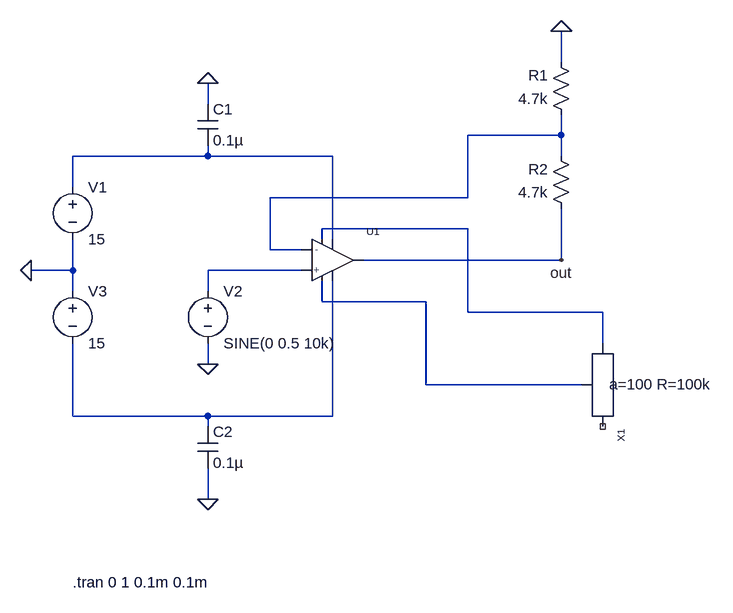
[diagram p0: schematic 741_block.asc]
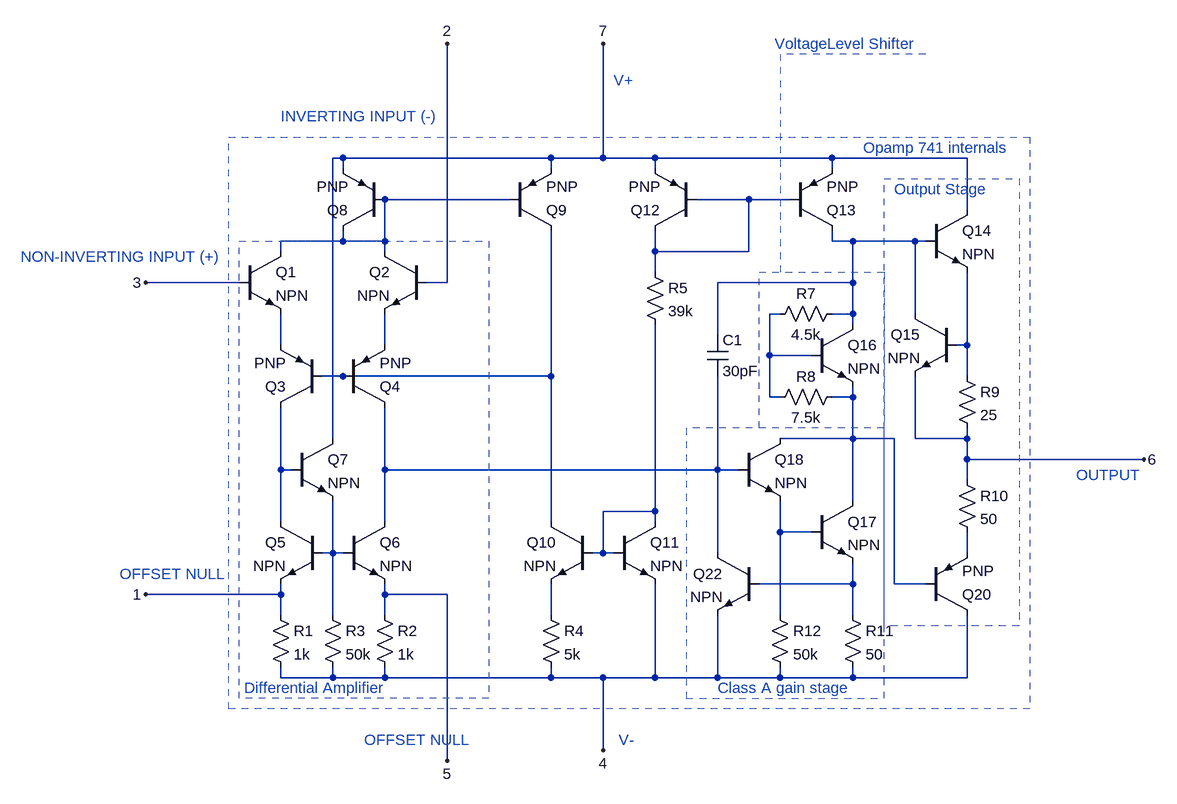
[diagram p1: sub-circuit 741.asc]
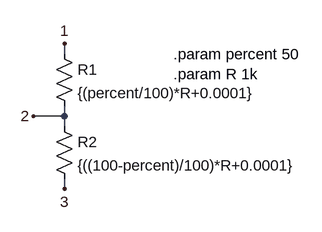
[diagram p2: sub-circuit potentionmeter.asc]
741_block.asc, the LTspice schematic file:
Version 4
SHEET 1 880 736
WIRE 416 -80 416 -128
WIRE -128 -16 -128 -48
WIRE 416 32 416 0
WIRE 416 32 272 32
WIRE -128 64 -128 48
WIRE -128 64 -336 64
WIRE 64 64 -128 64
WIRE 416 64 416 32
WIRE -336 112 -336 64
WIRE 272 128 272 32
WIRE 272 128 -32 128
WIRE 272 176 48 176
WIRE 48 192 48 176
WIRE 64 192 64 64
WIRE -32 208 -32 128
WIRE 16 208 -32 208
WIRE 416 224 416 144
WIRE 416 224 112 224
WIRE -336 240 -336 192
WIRE -336 240 -400 240
WIRE 16 240 -128 240
WIRE -336 272 -336 240
WIRE -128 272 -128 240
WIRE 48 288 48 256
WIRE 208 288 48 288
WIRE 272 304 272 176
WIRE 480 304 272 304
WIRE 480 352 480 304
WIRE -128 384 -128 352
WIRE 208 416 208 288
WIRE 448 416 208 416
WIRE -336 464 -336 352
WIRE -128 464 -336 464
WIRE 64 464 64 256
WIRE 64 464 -128 464
WIRE -128 480 -128 464
WIRE -128 592 -128 544
FLAG -128 384 0
FLAG -400 240 0
FLAG -128 592 0
FLAG -128 -48 0
FLAG 416 -128 0
FLAG 416 224 out
SYMBOL voltage -336 96 R0
WINDOW 123 0 0 Left 0
WINDOW 39 0 0 Left 0
SYMATTR InstName V1
SYMATTR Value 15
SYMBOL voltage -128 256 R0
WINDOW 123 0 0 Left 0
WINDOW 39 0 0 Left 0
SYMATTR InstName V2
SYMATTR Value SINE(0 0.5 10k)
SYMBOL voltage -336 256 R0
WINDOW 123 0 0 Left 0
WINDOW 39 0 0 Left 0
SYMATTR InstName V3
SYMATTR Value 15
SYMBOL cap -144 -16 R0
SYMATTR InstName C1
SYMATTR Value 0.1µ
SYMBOL cap -144 480 R0
SYMATTR InstName C2
SYMATTR Value 0.1µ
SYMBOL res 432 16 R180
WINDOW 0 36 76 Left 2
WINDOW 3 36 40 Left 2
SYMATTR InstName R1
SYMATTR Value 4.7k
SYMATTR SpiceLine tol=5
SYMBOL res 432 160 R180
WINDOW 0 36 76 Left 2
WINDOW 3 36 40 Left 2
SYMATTR InstName R2
SYMATTR Value 4.7k
SYMATTR SpiceLine tol=5
SYMBOL 741 32 224 R0
SYMATTR InstName U1
SYMBOL potentionmeter 464 368 R90
WINDOW 39 47 -185 VRight 2
SYMATTR InstName X1
SYMATTR SpiceLine a=100 R=100k
TEXT -336 720 Left 2 !.tran 0 1 0.1m 0.1m

741.asc, the sub-circuit schematic file:
Version 4
SHEET 1 2824 1124
WIRE 240 -16 224 -16
WIRE 560 -16 240 -16
WIRE 640 -16 640 -192
WIRE 640 -16 560 -16
WIRE 720 -16 640 -16
WIRE 992 -16 720 -16
WIRE 1200 -16 992 -16
WIRE 240 0 240 -16
WIRE 560 0 560 -16
WIRE 720 0 720 -16
WIRE 992 0 992 -16
WIRE 496 48 304 48
WIRE 864 48 784 48
WIRE 928 48 864 48
WIRE 1200 64 1200 -16
WIRE 240 112 240 96
WIRE 240 112 144 112
WIRE 304 112 304 48
WIRE 304 112 240 112
WIRE 992 112 992 96
WIRE 1024 112 992 112
WIRE 1120 112 1024 112
WIRE 1136 112 1120 112
WIRE 144 128 144 112
WIRE 304 128 304 112
WIRE 720 128 720 96
WIRE 864 128 864 48
WIRE 864 128 720 128
WIRE 720 160 720 128
WIRE 80 176 -64 176
WIRE 400 176 400 -192
WIRE 400 176 368 176
WIRE 1024 176 1024 112
WIRE 1024 176 816 176
WIRE 912 224 896 224
WIRE 1024 224 1024 176
WIRE 1024 224 992 224
WIRE 1120 224 1120 112
WIRE 1024 240 1024 224
WIRE 816 256 816 176
WIRE 144 272 144 224
WIRE 304 272 304 224
WIRE 1200 272 1200 160
WIRE 1200 272 1184 272
WIRE 896 288 896 224
WIRE 960 288 896 288
WIRE 240 320 208 320
WIRE 560 320 560 96
WIRE 560 320 240 320
WIRE 1200 320 1200 272
WIRE 896 352 896 288
WIRE 912 352 896 352
WIRE 1024 352 1024 336
WIRE 1024 352 992 352
WIRE 224 416 224 -16
WIRE 1024 416 1024 352
WIRE 1024 416 912 416
WIRE 1088 416 1024 416
WIRE 1120 416 1120 320
WIRE 1200 416 1200 400
WIRE 1200 416 1120 416
WIRE 1200 448 1200 416
WIRE 1472 448 1200 448
WIRE 144 464 144 368
WIRE 160 464 144 464
WIRE 304 464 304 368
WIRE 816 464 816 320
WIRE 816 464 304 464
WIRE 848 464 816 464
WIRE 1200 480 1200 448
WIRE 1024 512 1024 416
WIRE 720 528 720 240
WIRE 720 528 640 528
WIRE 144 544 144 464
WIRE 304 544 304 464
WIRE 560 544 560 320
WIRE 720 544 720 528
WIRE 912 560 912 512
WIRE 960 560 912 560
WIRE 224 592 224 512
WIRE 224 592 208 592
WIRE 240 592 224 592
WIRE 640 592 640 528
WIRE 640 592 624 592
WIRE 656 592 640 592
WIRE 816 592 816 464
WIRE 1200 592 1200 560
WIRE 1024 640 1024 608
WIRE 1024 640 880 640
WIRE 1088 640 1088 416
WIRE 1136 640 1088 640
WIRE 144 656 144 640
WIRE 144 656 -64 656
WIRE 304 656 304 640
WIRE 400 656 304 656
WIRE 144 688 144 656
WIRE 224 688 224 592
WIRE 304 688 304 656
WIRE 560 688 560 640
WIRE 912 688 912 560
WIRE 1024 688 1024 640
WIRE 144 784 144 768
WIRE 224 784 224 768
WIRE 224 784 144 784
WIRE 304 784 304 768
WIRE 304 784 224 784
WIRE 560 784 560 768
WIRE 560 784 304 784
WIRE 640 784 560 784
WIRE 720 784 720 640
WIRE 720 784 640 784
WIRE 816 784 816 688
WIRE 816 784 720 784
WIRE 912 784 912 768
WIRE 912 784 816 784
WIRE 1024 784 1024 768
WIRE 1024 784 912 784
WIRE 1200 784 1200 688
WIRE 1200 784 1024 784
WIRE 640 896 640 784
WIRE 400 912 400 656
FLAG -64 176 3
FLAG 400 -192 2
FLAG 1472 448 6
FLAG 640 896 4
FLAG 640 -192 7
FLAG -64 656 1
FLAG 400 912 5
SYMBOL npn 80 128 R0
SYMATTR InstName Q1
SYMBOL npn 368 128 M0
SYMATTR InstName Q2
SYMBOL pnp 208 368 R180
SYMATTR InstName Q3
SYMBOL pnp 240 368 M180
SYMATTR InstName Q4
SYMBOL npn 208 544 M0
SYMATTR InstName Q5
SYMBOL npn 240 544 R0
SYMATTR InstName Q6
SYMBOL npn 160 416 R0
SYMATTR InstName Q7
SYMBOL res 128 672 R0
SYMATTR InstName R1
SYMATTR Value 1k
SYMBOL res 288 672 R0
SYMATTR InstName R2
SYMATTR Value 1k
SYMBOL res 208 672 R0
SYMATTR InstName R3
SYMATTR Value 50k
SYMBOL res 544 672 R0
SYMATTR InstName R4
SYMATTR Value 5k
SYMBOL pnp 304 96 R180
SYMATTR InstName Q8
SYMBOL pnp 496 96 M180
SYMATTR InstName Q9
SYMBOL npn 624 544 M0
SYMATTR InstName Q10
SYMBOL npn 656 544 R0
SYMATTR InstName Q11
SYMBOL pnp 784 96 R180
SYMATTR InstName Q12
SYMBOL res 704 144 R0
SYMATTR InstName R5
SYMATTR Value 39k
SYMBOL pnp 928 96 M180
SYMATTR InstName Q13
SYMBOL npn 1136 64 R0
SYMATTR InstName Q14
SYMBOL npn 1184 224 M0
SYMATTR InstName Q15
SYMBOL cap 800 256 R0
SYMATTR InstName C1
SYMATTR Value 30pF
SYMBOL res 1008 208 R90
WINDOW 0 0 56 VBottom 2
WINDOW 3 32 56 VTop 2
SYMATTR InstName R7
SYMATTR Value 4.5k
SYMBOL res 1008 336 R90
WINDOW 0 0 56 VBottom 2
WINDOW 3 32 56 VTop 2
SYMATTR InstName R8
SYMATTR Value 7.5k
SYMBOL npn 960 240 R0
SYMATTR InstName Q16
SYMBOL res 1184 304 R0
SYMATTR InstName R9
SYMATTR Value 25
SYMBOL res 1184 464 R0
SYMATTR InstName R10
SYMATTR Value 50
SYMBOL res 1008 672 R0
SYMATTR InstName R11
SYMATTR Value 50
SYMBOL res 896 672 R0
SYMATTR InstName R12
SYMATTR Value 50k
SYMBOL npn 960 512 R0
SYMATTR InstName Q17
SYMBOL npn 880 592 M0
SYMATTR InstName Q22
SYMBOL npn 848 416 R0
SYMATTR InstName Q18
SYMBOL pnp 1136 688 M180
SYMATTR InstName Q20
TEXT 1040 -32 Left 2 ;Opamp 741 internals
TEXT -256 136 Left 2 ;NON-INVERTING INPUT (+)
TEXT 144 -80 Left 2 ;INVERTING INPUT (-)
TEXT 656 -136 Left 2 ;V+
TEXT 1368 472 Left 2 ;OUTPUT
TEXT 664 880 Left 2 ;V-
TEXT 272 880 Left 2 ;OFFSET NULL
TEXT -104 624 Left 2 ;OFFSET NULL
TEXT 88 800 Left 2 ;Differential Amplifier
TEXT 816 800 Left 2 ;Class A gain stage
TEXT 1088 32 Left 2 ;Output Stage
TEXT 904 -192 Left 2 ;VoltageLevel Shifter
LINE Normal 912 -176 912 160 2
LINE Normal 1136 -176 912 -176 2
RECTANGLE Normal 64 -48 1296 832 2
RECTANGLE Normal 464 816 80 112 2
RECTANGLE Normal 1072 400 880 160 2
RECTANGLE Normal 1072 16 1280 704 2
RECTANGLE Normal 768 816 1072 400 2

potentionmeter.asc, the sub-circuit schematic file:
Version 4
SHEET 1 1824 680
WIRE 240 -416 240 -432
WIRE 240 -320 240 -336
WIRE 240 -320 192 -320
WIRE 240 -304 240 -320
WIRE 240 -208 240 -224
FLAG 240 -432 1
FLAG 192 -320 2
FLAG 240 -208 3
SYMBOL res 224 -432 R0
SYMATTR InstName R1
SYMATTR Value {(percent/100)*R+0.0001}
SYMBOL res 224 -320 R0
SYMATTR InstName R2
SYMATTR Value {((100-percent)/100)*R+0.0001}
TEXT 408 -416 Left 2 !.param percent 50\n.param R 1k

The netlist it stands for:
* 741_block.asc
V1 N002 0 15
V2 N004 0 SINE(0 0.5 10k)
V3 0 N006 15
C1 0 N002 0.1µ
C2 N006 0 0.1µ
R1 N001 0 4.7k tol=5
R2 out N001 4.7k tol=5
XU1 N003 N001 N004 N006 N005 out N002 741
XX1 N003 N005 NC_01 potentionmeter params: a=100 R=100k

* block symbol definitions
.subckt 741 1 2 3 4 5 6 7
Q1 N001 3 N005 0 NPN
Q2 N001 2 N006 0 NPN
Q3 N010 N008 N005 0 PNP
Q4 N011 N008 N006 0 PNP
Q5 N010 N014 1 0 NPN
Q6 N011 N014 5 0 NPN
Q7 7 N010 N014 0 NPN
R1 1 4 1k
R2 5 4 1k
R3 N014 4 50k
R4 N017 4 5k
Q8 N001 N001 7 0 PNP
Q9 N008 N001 7 0 PNP
Q10 N008 N012 N017 0 NPN
Q11 N012 N012 4 0 NPN
Q12 N002 N002 7 0 PNP
R5 N002 N012 39k
Q13 N003 N002 7 0 PNP
Q14 7 N003 N007 0 NPN
Q15 N003 N007 6 0 NPN
C1 N003 N011 30pF
R7 N003 N004 4.5k
R8 N009 N004 7.5k
Q16 N003 N004 N009 0 NPN
R9 N007 6 25
R10 6 N015 50
R11 N016 4 50
R12 N013 4 50k
Q17 N009 N013 N016 0 NPN
Q22 N011 N016 4 0 NPN
Q18 N009 N011 N013 0 NPN
Q20 4 N009 N015 0 PNP
* Opamp 741 internals
* NON-INVERTING INPUT (+)
* INVERTING INPUT (-)
* V+
* OUTPUT
* V-
* OFFSET NULL
* OFFSET NULL
* Differential Amplifier
* Class A gain stage
* Output Stage
* VoltageLevel Shifter
.ends 741

.subckt potentionmeter 1 2 3
R1 1 2 {(percent/100)*R+0.0001}
R2 2 3 {((100-percent)/100)*R+0.0001}
.param percent 50
.param R 1k
.ends potentionmeter

.model NPN NPN
.model PNP PNP
.lib standard.bjt
.tran 0 1 0.1m 0.1m
.backanno
.end